# EAGLE design ATiny2PiRM12B (EAGLE 6.5.0)
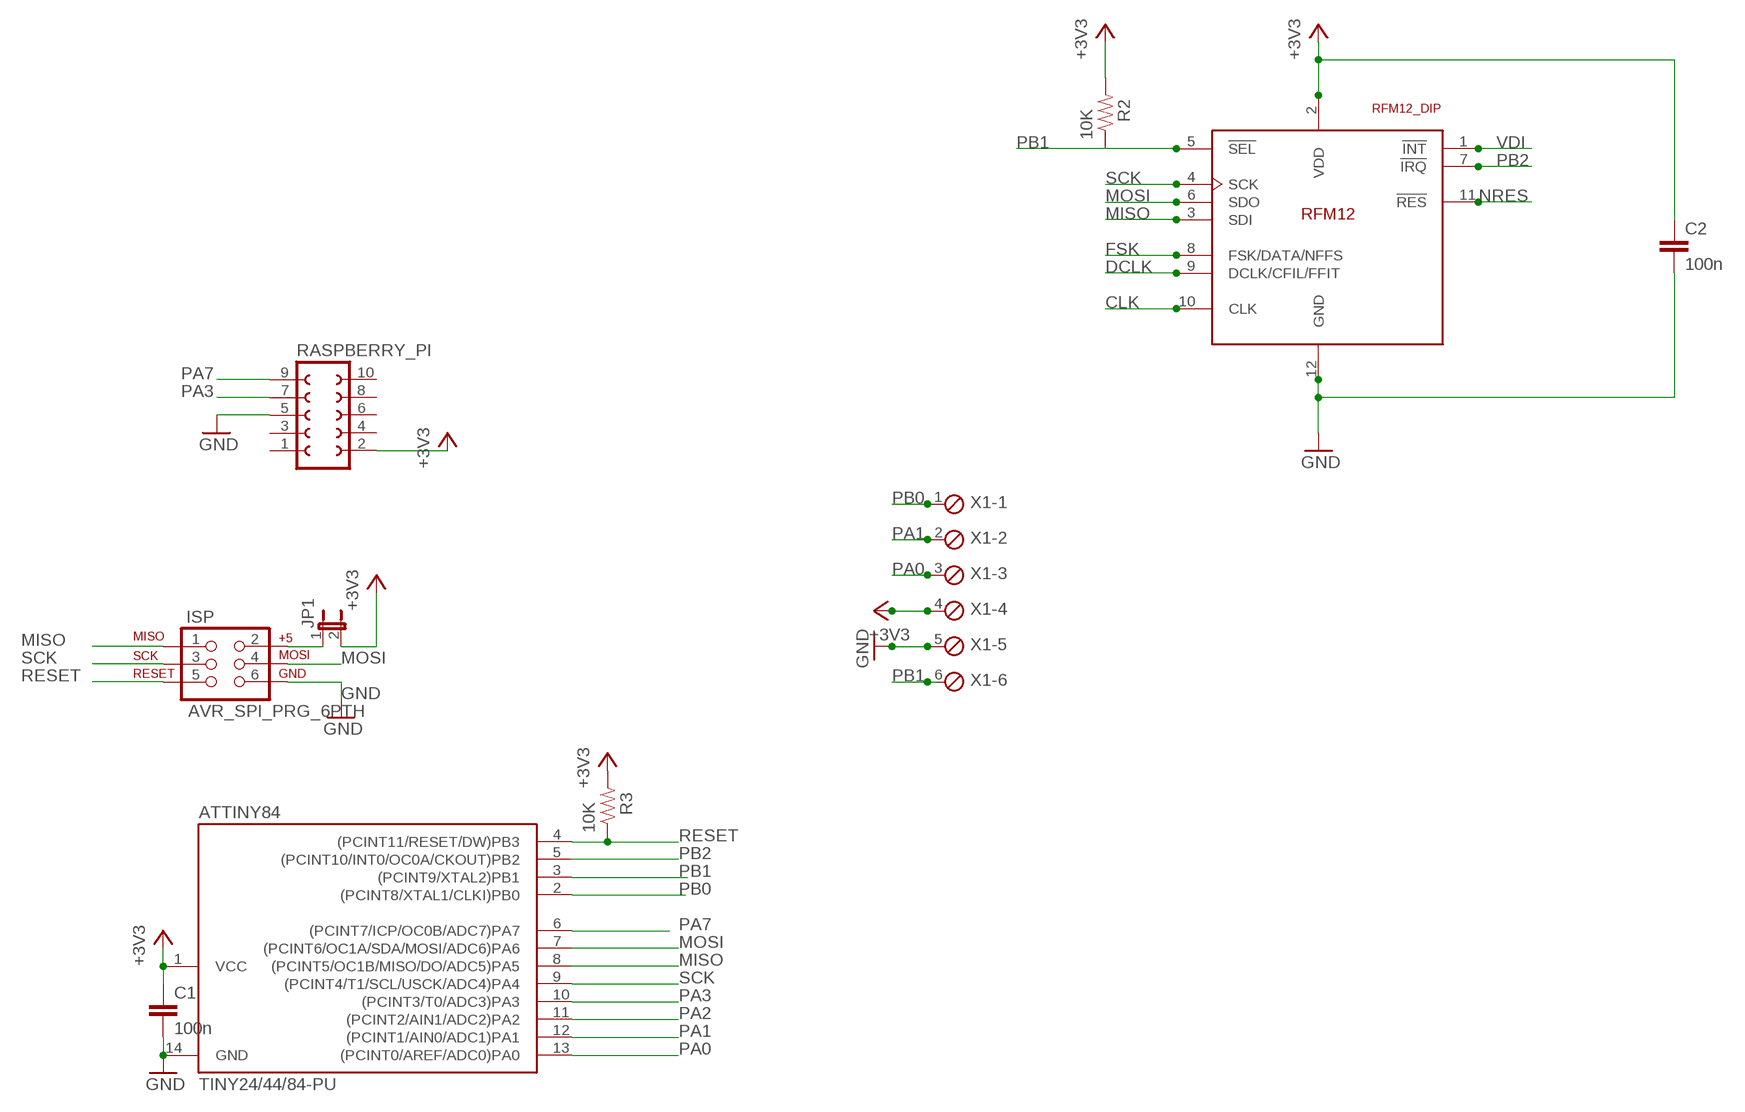
[diagram p0: schematic, sheet 1]

## Parts
ATTINY84  TINY24/44/84-PU  [DIL14]
C1  100n  C-EU025-024X044  [C025-024X044]
C2  100n  C-EU025-024X044  [C025-024X044]
ISP  AVR_SPI_PRG_6PTH  [2X3]
JP1  JUMPER-2PTH  [1X02]
R2  10K  RESISTORAXIAL-0.3  [AXIAL-0.3]
R3  10K  RESISTORAXIAL-0.3  [AXIAL-0.3]
RASPBERRY_PI  FE05-2  [FE05-2]
U$1  RFM12_DIP  [DIL-2MM-2X06]
X1  MPT6  [6POL254]

## Nets
+3V3 [power]: ATTINY84.1(VCC) C1.1 C2.1 JP1.2 R2.P$2 R3.P$2 RASPBERRY_PI.2 U$1.2(VDD) X1.4
CLK: U$1.10(CLK)
DCLK: U$1.9(DCLK/CFIL/FFIT)
FSK: U$1.8(FSK/DATA/NFFS)
GND [power]: ATTINY84.14(GND) C1.2 C2.2 ISP.6 RASPBERRY_PI.5 U$1.12(GND) X1.5
MISO: ATTINY84.8((PCINT5/OC1B/MISO/DO/ADC5)PA5) ISP.1 U$1.3(SDI)
MOSI: ATTINY84.7((PCINT6/OC1A/SDA/MOSI/ADC6)PA6) ISP.4 U$1.6(SDO)
N$1: ISP.2 JP1.1
NRES: U$1.11(!RES)
PA0: ATTINY84.13((PCINT0/AREF/ADC0)PA0) X1.3
PA1 [power]: ATTINY84.12((PCINT1/AIN0/ADC1)PA1) X1.2
PA2: ATTINY84.11((PCINT2/AIN1/ADC2)PA2)
PA3: ATTINY84.10((PCINT3/T0/ADC3)PA3) RASPBERRY_PI.7
PA7: ATTINY84.6((PCINT7/ICP/OC0B/ADC7)PA7) RASPBERRY_PI.9
PB0: ATTINY84.2((PCINT8/XTAL1/CLKI)PB0) X1.1
PB1: ATTINY84.3((PCINT9/XTAL2)PB1) R2.P$1 U$1.5(!SEL) X1.6
PB2: ATTINY84.5((PCINT10/INT0/OC0A/CKOUT)PB2) U$1.7(!IRQ)
RESET: ATTINY84.4((PCINT11/RESET/DW)PB3) ISP.5 R3.P$1
SCK: ATTINY84.9((PCINT4/T1/SCL/USCK/ADC4)PA4) ISP.3 U$1.4(SCK)
VDI: U$1.1(!INT)
Unconnected: RASPBERRY_PI.1 RASPBERRY_PI.3 RASPBERRY_PI.4 RASPBERRY_PI.6 RASPBERRY_PI.8 RASPBERRY_PI.10

## Library data of the parts
ATTINY84 = avr-7:TINY24/44/84
C1 C2 = rcl:C-EU: CAPACITOR, European symbol
ISP = SparkFun:AVR_SPI_PRG_6: AVR ISP 6 Pin This is the reduced ISP connector for AVR programming. Common on Arduino. This footprint will take up less PCB space and can be used with a 10-pin to 6-pin adapter such as SKU: BOB-08508
JP1 = SparkFun:JUMPER-2: Jumper Basic 0.1" spaced jumper. Use with breakaway headers.
R2 R3 = SparkFun:RESISTOR: Resistor Basic schematic elements and footprints for 0603, 1206, and PTH resistors.
RASPBERRY_PI = con-lsta:FE05-2: FEMALE HEADER; OC_FARNELL: unknown; OC_NEWARK: unknown
U$1 = rfm_12:RFM12_DIP: RFM12 is a low costing ISM band transceiver module implemented with unique PLL. It works signal ranges from 315/433/868/915MHZ bands, comply with FCC, ETSI regulation. The SPI interface is used to communicate with microcontroller for parameter setting.
X1 = con-phoenix-254:MPT6: PHOENIX CONNECTOR; OC_FARNELL: unknown; OC_NEWARK: unknown

## Net classes
0 default: width 0.254 mm, drill 0.254 mm, clearance 0.254 mm
1 power: width 0.305 mm, drill 0.305 mm, clearance 0.305 mm

## Board
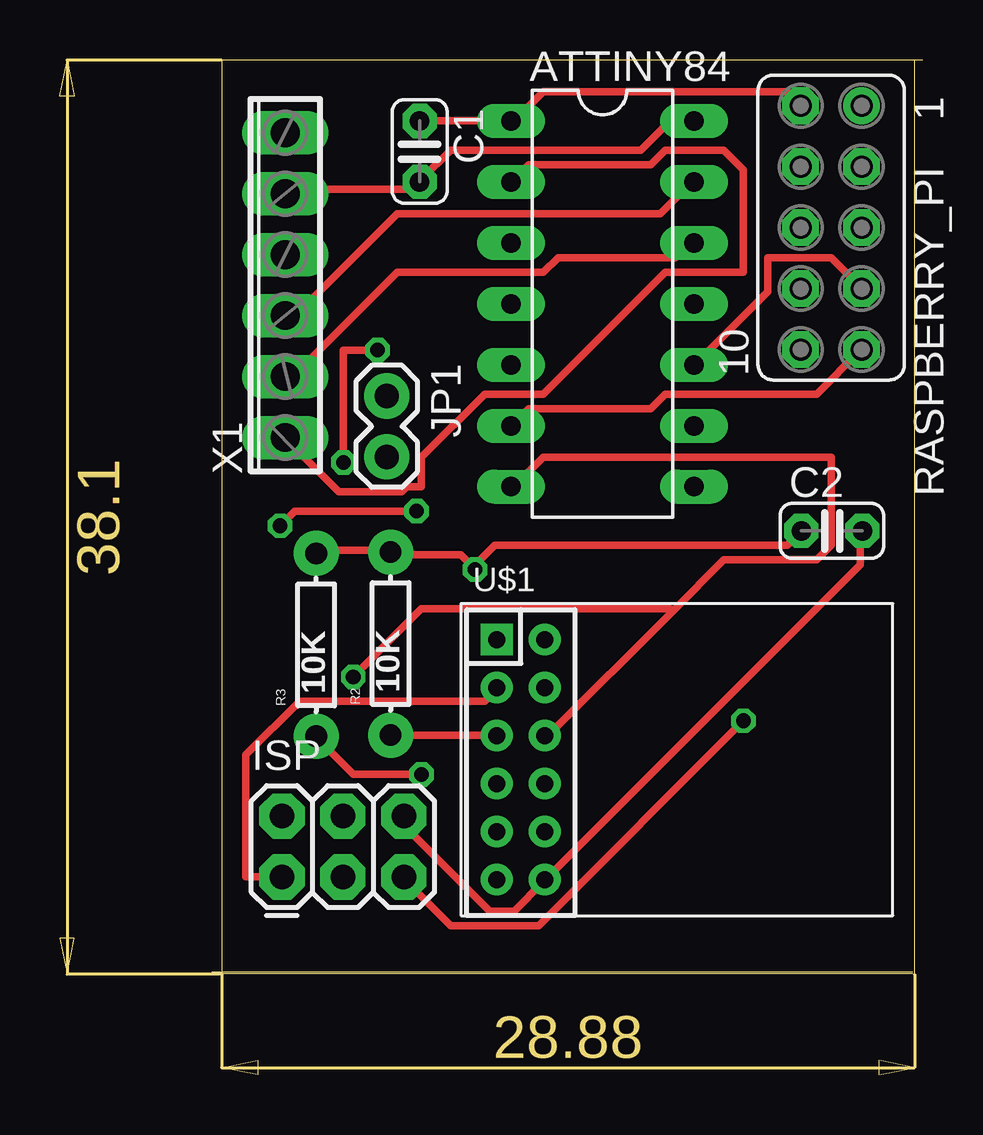
[diagram p1: board, top side]
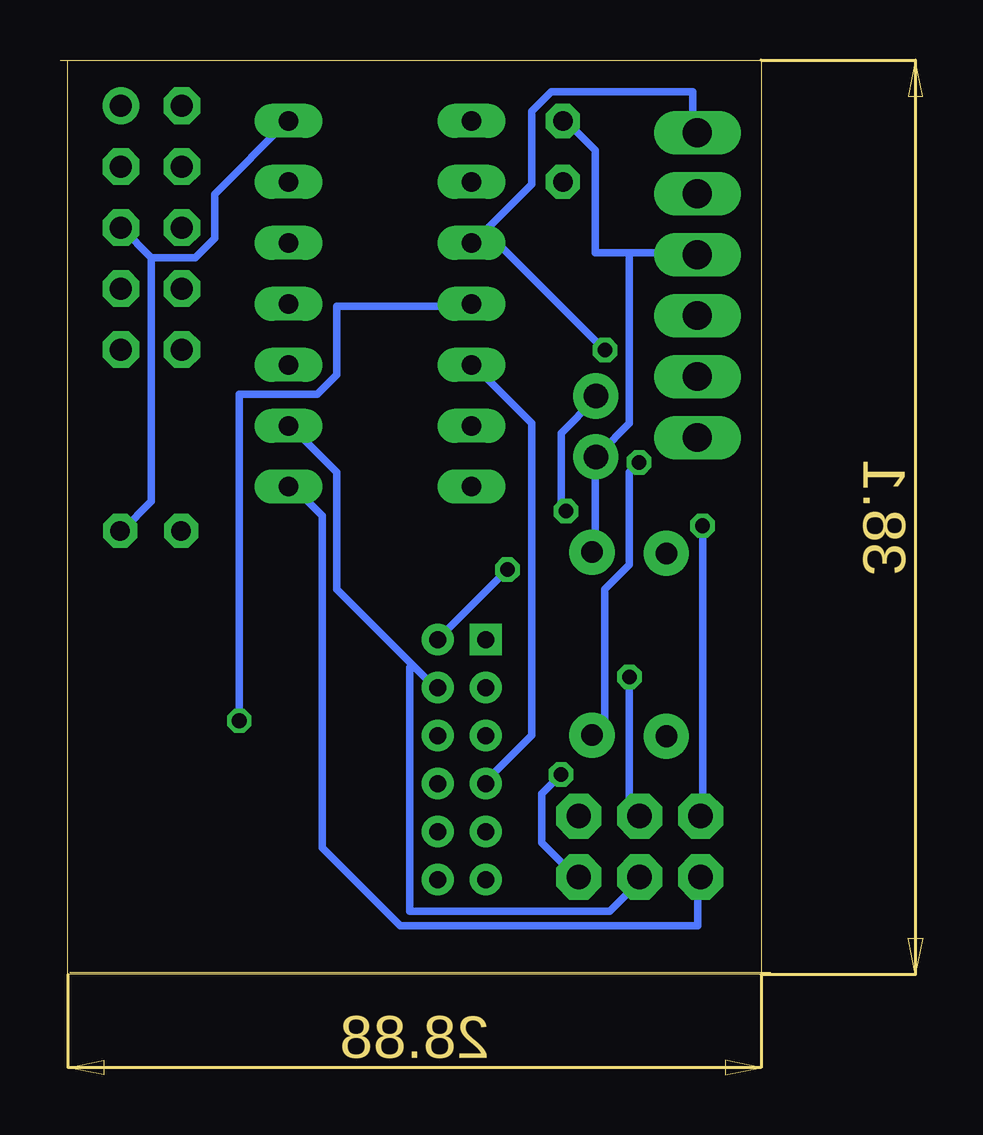
[diagram p2: board, bottom side, seen from below]

Size 29.62 x 38.1 mm. Coordinates in mm from the lower left corner, seen from the top.
Outline: 29.29,0 29.29,38.09
Outline: 0.41,0 0.41,38.1 29.62,38.1
Outline: 29.21,0.1 0,0.1
Outline: 29.21,0.02 0,0.02
Copper layers (1*16): Top 0.035mm / dielectric 1.5mm / Bottom 0.035mm
Design rules "default": minimum track width 12mil, minimum drill 24mil, track to track 12mil, track to pad 12mil, pad to pad 12mil, via to via 14mil, smd to smd 10mil, copper to edge 12mil, drill to drill 8mil, minimum pad ring 12mil, minimum via ring 8mil, stop-mask expansion 4mil, vias tented up to drill 0mil, thermal gap 10mil

### Footprints (pad centres in the part's own frame; a part is rotated, then mirrored left to right if it is on the bottom)
DIL14 = drill 0.813 long: 1 -7.62,-3.81; 2 -5.08,-3.81; 3 -2.54,-3.81; 4 0,-3.81; 5 2.54,-3.81; 6 5.08,-3.81; 7 7.62,-3.81; 8 7.62,3.81; 9 5.08,3.81; 10 2.54,3.81; 11 0,3.81; 12 -2.54,3.81; 13 -5.08,3.81; 14 -7.62,3.81
C025-024X044 = drill 0.813 octagon: 1 -1.27,0; 2 1.27,0
2X3 = drill 1.016 pad 1.88 octagon: 1 0,0; 2 0,2.54; 3 2.54,0; 4 2.54,2.54; 5 5.08,0; 6 5.08,2.54
1X02 = drill 1.016 pad 1.88: 1 0,0; 2 2.54,0
AXIAL-0.3 = drill 0.9 pad 1.88: P$1 -3.81,0; P$2 3.81,0
FE05-2 = drill 0.914: 1 -5.08,1.27 | drill 0.914 octagon: 2 -5.08,-1.27; 3 -2.54,1.27; 4 -2.54,-1.27; 5 0,1.27; 6 0,-1.27; 7 2.54,1.27; 8 2.54,-1.27; 9 5.08,1.27; 10 5.08,-1.27
DIL-2MM-2X06 = drill 0.711 square: 1 -1,5 | drill 0.711: 2 1,5; 3 -1,3; 4 1,3; 5 -1,1; 6 1,1; 7 -1,-1; 8 1,-1; 9 -1,-3; 10 1,-3; 11 -1,-5; 12 1,-5
6POL254 = drill 1.2 pad 1.778 long: 1 -6.35,0; 2 -3.81,0; 3 -1.27,0; 4 1.27,0; 5 3.81,0; 6 6.35,0

### Placement (x,y rotation side)
ATTINY84  16.28,27.94 270 top
C1  8.66,34.29 270 top
C2  25.84,18.48 0 top
ISP  2.93,4.06 0 top
JP1  7.29,24.1 270 top
R2  7.45,13.78 90 top
R3  4.35,13.73 90 top
RASPBERRY_PI  25.81,31.11 270 top
U$1  12.88,8.95 0 top
X1  3.06,28.72 90 top

### Tracks (layer width: path | path; a pad name or v marks a point on that pad's centre or on a via)
+3V3  (via drill 0.61)
  Top 0.305: C2.1 24.39,18.29 23.98,17.88 11.79,17.88 10.98,17.07 v10.98,16.87 10.37,17.48 7.52,17.48 R2.P$2 7.32,17.68 4.47,17.68 R3.P$2 | C1.1 ATTINY84.1 12.6,35.56 13.82,36.78 23.98,36.78 24.39,36.37 RASPBERRY_PI.2
  Bottom 0.305: v10.98,16.87 13.82,14.02 U$1.2 | R2.P$2 7.32,17.68 7.32,21.54 JP1.2 7.12,21.74 5.9,22.96 5.9,30.07 | 5.9,30.07 7.32,30.07 7.32,34.34 8.54,35.56 C1.1 | 5.9,30.07 3.25,30.07 X1.4
GND
  Top 0.305: ISP.6 8.13,6.5 8.13,6.1 11.59,2.64 12.6,2.64 13.82,3.86 U$1.12 14.02,4.06 27.03,17.07 27.03,18.29 C2.2 | X1.5 3.25,32.72 8.33,32.72 8.54,32.92 C1.2 8.74,33.12 9.96,34.34 17.88,34.34 19.1,35.56 ATTINY84.14
  Bottom 0.305: 25.81,29.87 25.81,19.71 27.03,18.49 C2.2 | 25.81,29.87 27.03,31.09 RASPBERRY_PI.5 | 25.81,29.87 23.98,29.87 23.17,30.68 23.17,32.51 20.12,35.56 ATTINY84.14
MISO
  Top 0.305: U$1.3 11.79,11.79 11.38,11.38 3.66,11.38 1.43,9.14 1.43,4.06 2.85,4.06 ISP.1
  Bottom 0.305: ATTINY84.8 19.92,20.32 18.7,19.1 18.7,5.28 15.45,2.03 3.05,2.03 3.05,3.86 ISP.1
MOSI  (via drill 0.61)
  Top 0.305: 19.21,15.14 21.34,17.27 25.2,17.27 25.81,17.88 25.81,21.54 13.82,21.54 12.6,20.32 ATTINY84.7 | 19.21,15.14 14.02,9.96 U$1.6 | v5.9,12.39 8.74,15.24 19.1,15.24 19.21,15.14
  Bottom 0.305: v5.9,12.39 5.9,7.11 5.49,6.71 ISP.4
N$1  (via drill 0.61)
  Top 0.305: v2.85,18.69 3.46,19.3 v8.54,19.3
  Bottom 0.305: v2.85,18.69 2.85,6.71 ISP.2 | v8.54,19.3 8.74,19.51 8.74,22.55 7.32,23.98 JP1.1
PA0
  Top 0.305: ATTINY84.13 19.92,32.92 18.7,31.7 7.72,31.7 3.66,27.64 3.25,27.64 X1.3
PA1
  Top 0.305: ATTINY84.12 19.92,30.48 19.31,29.87 14.43,29.87 13.82,29.26 7.72,29.26 3.46,24.99 3.25,24.99 X1.2
PA3
  Top 0.305: ATTINY84.10 20.12,25.4 23.17,28.45 23.17,29.87 25.81,29.87 27.03,28.65 RASPBERRY_PI.7
PA7
  Top 0.305: ATTINY84.6 12.6,22.96 13.21,23.57 18.29,23.57 18.9,24.18 25.2,24.18 27.03,26.01 RASPBERRY_PI.9
PB0
  Top 0.305: ATTINY84.2 12.6,33.12 13.21,33.73 18.29,33.73 18.9,34.34 21.34,34.34 22.15,33.53 22.15,29.26 18.9,29.26 13.82,24.18 11.38,24.18 8.74,21.54 8.74,20.32 8.13,20.32 7.93,20.12 5.29,20.12 3.05,22.35 X1.1
PB1  (via drill 0.61)
  Top 0.305: U$1.5 11.79,9.96 7.52,9.96 R2.P$1 | v5.49,21.34 5.49,26.01 v6.91,26.01
  Bottom 0.305: X1.6 3.25,35.15 3.25,36.78 9.15,36.78 9.96,35.97 9.96,32.92 12.4,30.48 ATTINY84.3 11.79,30.89 v6.91,26.01 | v5.49,21.34 5.9,20.93 5.9,17.07 6.91,16.05 6.91,10.57 7.32,10.16 R2.P$1
PB2
  Bottom 0.305: U$1.7 11.79,8.13 9.96,9.96 9.96,22.96 12.4,25.4 ATTINY84.5
RESET  (via drill 0.61)
  Top 0.305: v22.15,10.57 13.62,2.03 9.96,2.03 8.13,3.86 ISP.5 | v8.74,8.33 5.9,8.33 4.47,9.75 R3.P$1
  Bottom 0.305: v22.15,10.57 22.15,24.18 18.9,24.18 18.09,24.99 18.09,27.84 12.6,27.84 ATTINY84.4 | v8.74,8.33 9.55,7.52 9.55,5.49 8.13,4.06 ISP.5
SCK
  Bottom 0.305: 14.94,12.9 18.09,16.05 18.09,20.93 19.92,22.76 ATTINY84.9 | 14.94,12.9 14.02,11.99 U$1.4 | ISP.3 5.49,3.86 6.71,2.64 15.04,2.64 15.04,12.8 14.94,12.9